# EAGLE design IMU (EAGLE 6.5.0)
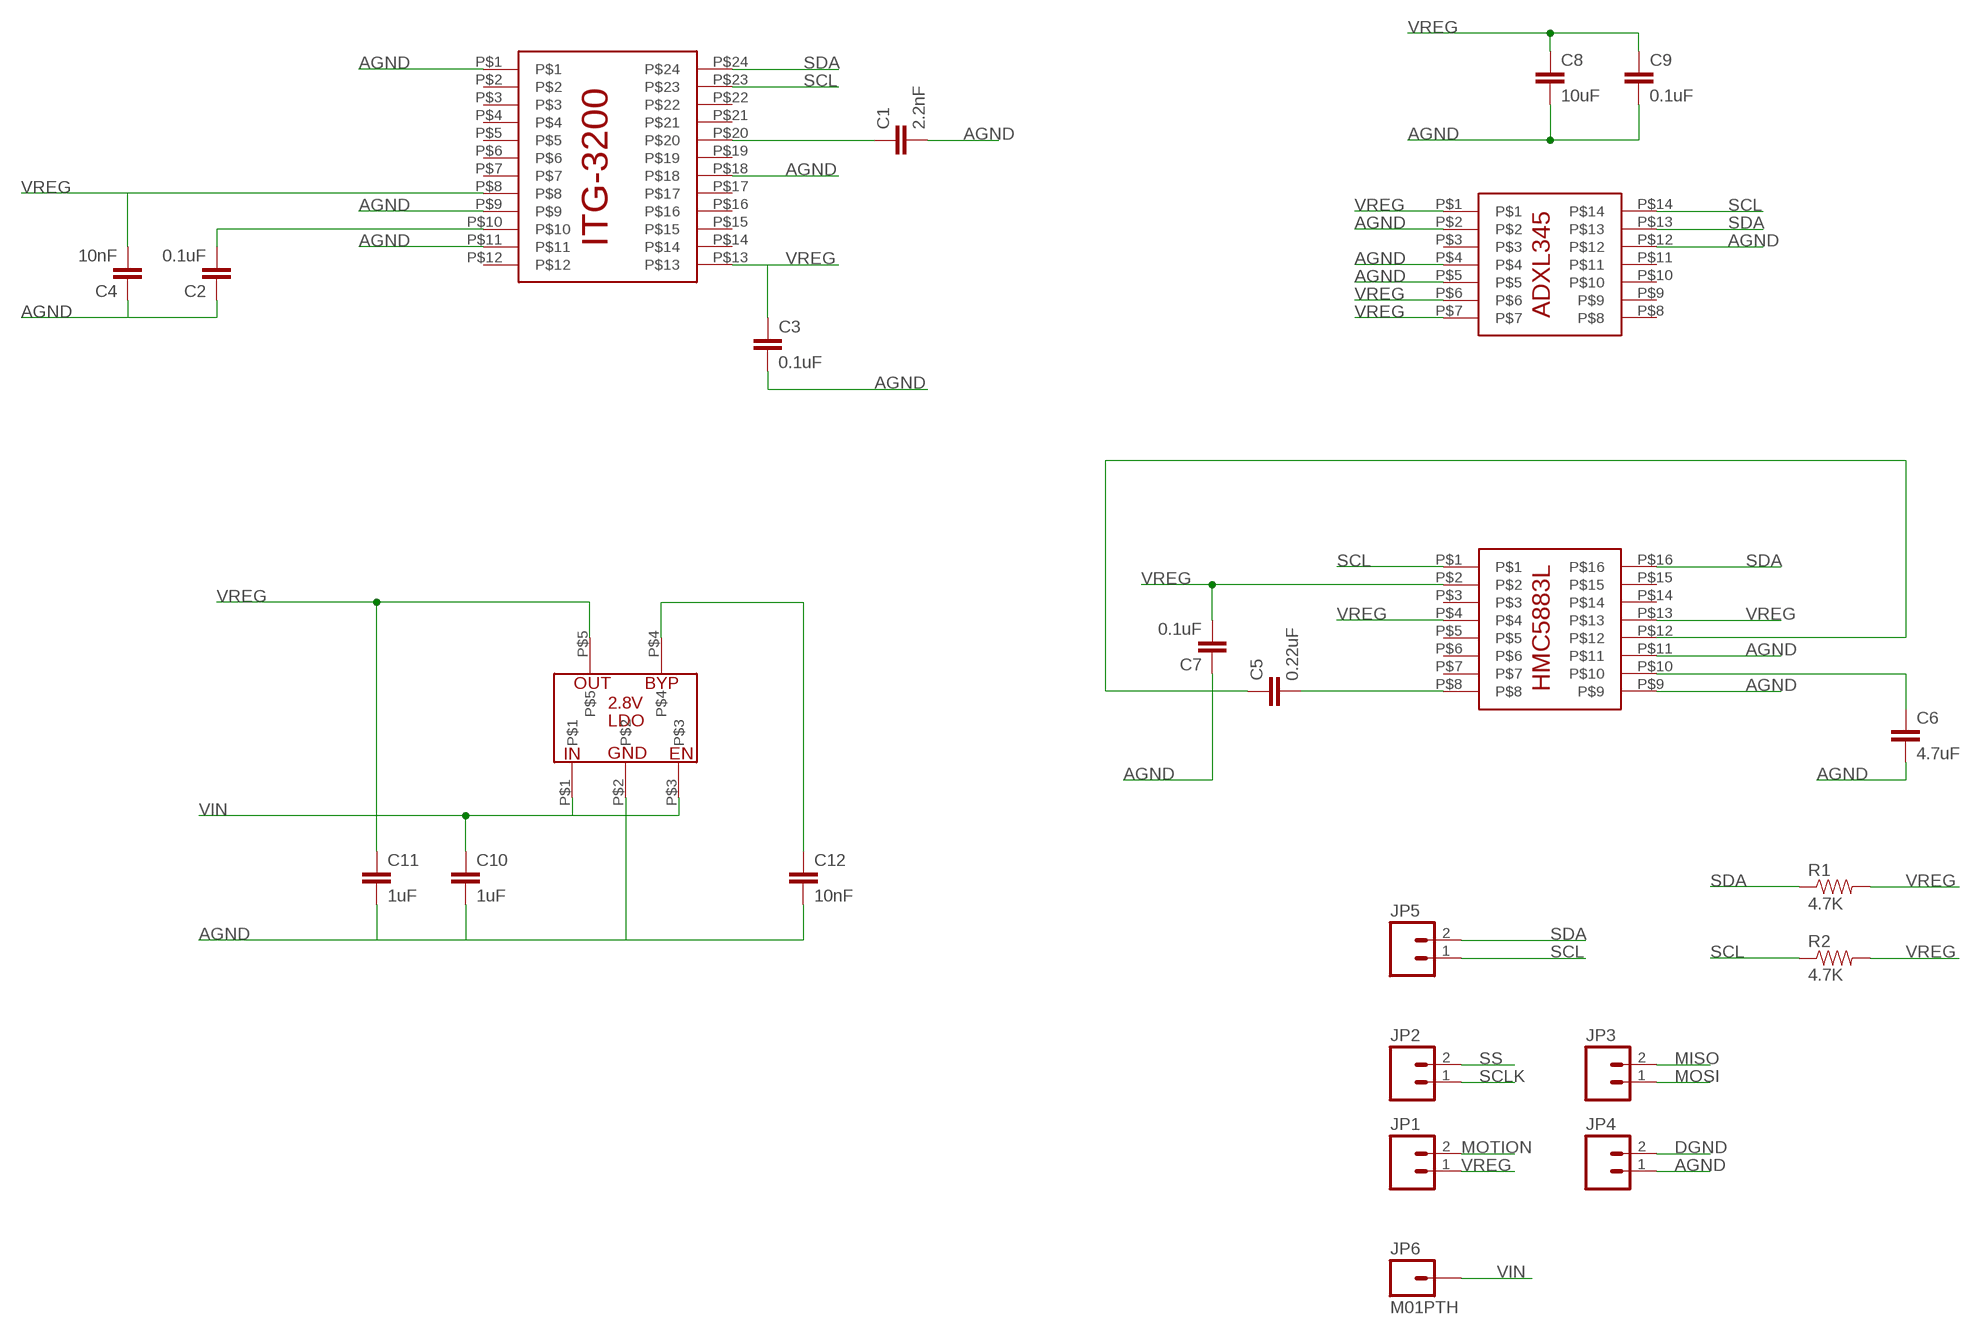
[diagram p0: schematic, sheet 1]

## Parts
C1  2.2nF  CAP0603-CAP  [0603-CAP]
C2  0.1uF  CAP0603-CAP  [0603-CAP]
C3  0.1uF  CAP0603-CAP  [0603-CAP]
C4  10nF  CAP0603-CAP  [0603-CAP]
C5  0.22uF  CAP0603-CAP  [0603-CAP]
C6  4.7uF  CAP0603-CAP  [0603-CAP]
C7  0.1uF  CAP0603-CAP  [0603-CAP]
C8  10uF  CAP0603-CAP  [0603-CAP]
C9  0.1uF  CAP0603-CAP  [0603-CAP]
C10  1uF  CAP0603-CAP  [0603-CAP]
C11  1uF  CAP0603-CAP  [0603-CAP]
C12  10nF  CAP0603-CAP  [0603-CAP]
JP1  M02PTH  [1X02]
JP2  M02PTH  [1X02]
JP3  M02PTH  [1X02]
JP4  M02PTH  [1X02]
JP5  M02PTH  [1X02]
JP6  M01PTH  [1X01]
R1  4.7K  RESISTOR0603-RES  [0603-RES]
R2  4.7K  RESISTOR0603-RES  [0603-RES]
U$2  ADXL345  [ADXL345]
U$3  HMC5883L  [HMC5883L]
U$4  ITG-3200  [ITG-3200]
U$5  NCP700BMT28TBG__2.8V_LDO  [NCP700BMT28TBG__2.8V_LDO]

## Nets
AGND: C1.2 C2.1 C3.2 C4.1 C6.2 C7.1 C8.2 C9.2 C10.2 C11.2 C12.2 JP4.1 U$2.P$2 U$2.P$4 U$2.P$5 U$2.P$12 U$3.P$9 U$3.P$11 U$4.P$1 U$4.P$9 U$4.P$11 U$4.P$18 U$5.P$2
DGND: JP4.2
MISO: JP3.2
MOSI: JP3.1
MOTION: JP1.2
N$2: C1.1 U$4.P$20
N$3: C2.2 U$4.P$10
N$4: C5.2 U$3.P$8
N$5: C5.1 U$3.P$12
N$6: C6.1 U$3.P$10
N$9: C12.1 U$5.P$4
SCL: JP5.1 R2.1 U$2.P$14 U$3.P$1 U$4.P$23
SCLK: JP2.1
SDA: JP5.2 R1.1 U$2.P$13 U$3.P$16 U$4.P$24
SS: JP2.2
VIN: C10.1 JP6.1 U$5.P$1 U$5.P$3
VREG: C3.1 C4.2 C7.2 C8.1 C9.1 C11.1 JP1.1 R1.2 R2.2 U$2.P$1 U$2.P$6 U$2.P$7 U$3.P$2 U$3.P$4 U$3.P$13 U$4.P$8 U$4.P$13 U$5.P$5
Unconnected: U$2.P$3 U$2.P$8 U$2.P$9 U$2.P$10 U$2.P$11 U$3.P$3 U$3.P$5 U$3.P$6 U$3.P$7 U$3.P$14 U$3.P$15 U$4.P$2 U$4.P$3 U$4.P$4 U$4.P$5 U$4.P$6 U$4.P$7 U$4.P$12 U$4.P$14 U$4.P$15 U$4.P$16 U$4.P$17 U$4.P$19 U$4.P$21 U$4.P$22

## Library data of the parts
C1-C12 = SparkFun-Capacitors:CAP: Capacitor Standard 0603 ceramic capacitor, and 0.1" leaded capacitor.
JP1-JP5 = SparkFun-Connectors:M02: Header 2 Standard 2-pin 0.1" header. Use with straight break away headers (SKU : PRT-00116), right angle break away headers (PRT-00553), swiss pins (PRT-00743), machine pins (PRT-00117), and female headers (PRT-00115). Molex polarized connector foot print use with SKU : PRT-08233 with associated crimp pins and housings.
JP6 = SparkFun-Connectors:M01: Header 1 Standard 1-pin 0.1" header. Use with straight break away headers (SKU : PRT-00116), right angle break away headers (PRT-00553), swiss pins (PRT-00743), machine pins (PRT-00117), and female headers (PRT-00115).
R1 R2 = SparkFun-Resistors:RESISTOR: Resistor Basic schematic elements and footprints for 0603, 1206, and PTH resistors.
U$2 = JKCustom:ADXL345
U$3 = JKCustom:HMC5883L
U$4 = JKCustom:ITG-3200
U$5 = JKCustom:NCP700BMT28TBG__2.8V_LDO

## Board
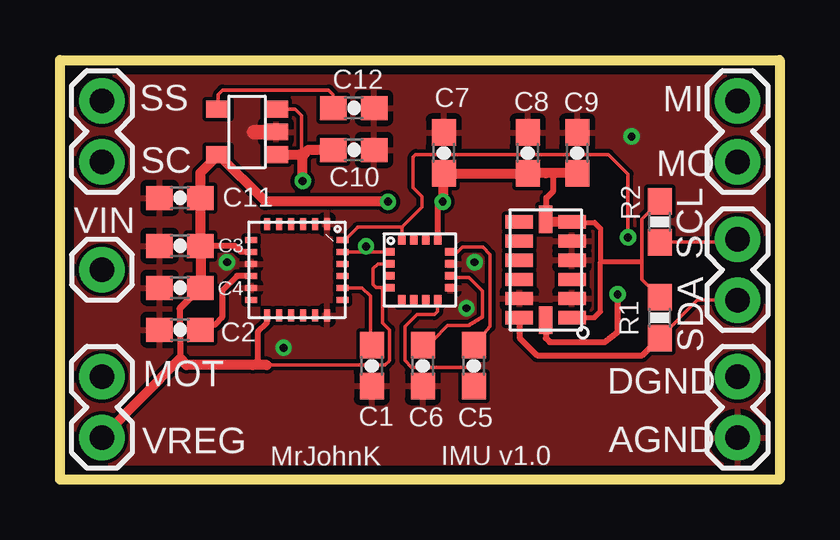
[diagram p1: board, top side]
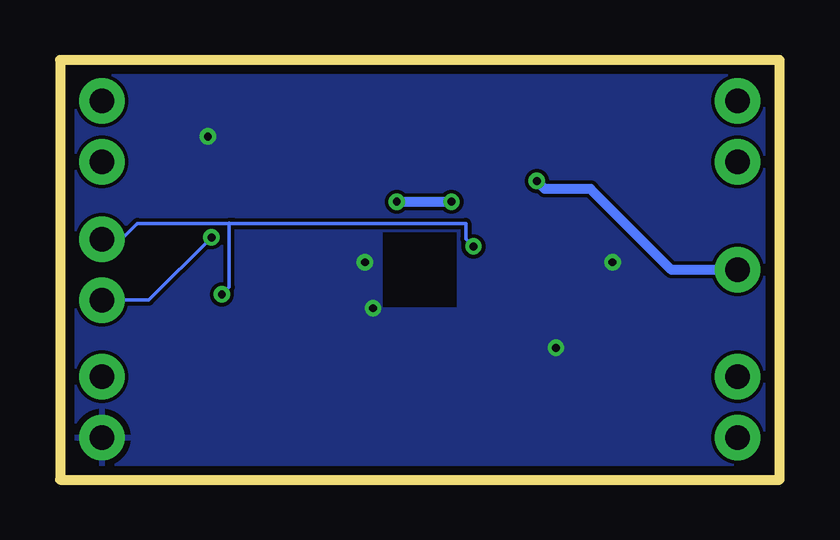
[diagram p2: board, bottom side, seen from below]

Size 30 x 17.5 mm. Coordinates in mm from the lower left corner, seen from the top.
Outline: 0,17.5 30,17.5 30,0 0,0 0,17.5
Copper layers (1*16): Top 0.0356mm / dielectric 1.5011mm / Bottom 0.0356mm
Design rules "LaenPCBOrder *": minimum track width 6mil, minimum drill 13mil, track to track 6mil, track to pad 6mil, pad to pad 6mil, via to via 6mil, smd to smd 6mil, copper to edge 15mil, drill to drill 6mil, minimum pad ring 7mil, minimum via ring 7mil, stop-mask expansion 3mil, vias tented up to drill 0mil, thermal gap 10mil
tKeepout: area 13.5,7.2 to 16.5,7.2; area 14,7.7 to 16,9.8; area 13.5,9.7 to 14,10.2; area 16,9.8 to 16.5,10.2; area 16,7.2 to 16.5,7.8; area 13.5,7.3 to 14,7.8
bKeepout: area 13.5,7.2 to 16.5,7.2; area 13.5,7.2 to 16.5,10.3; area 13.5,9.8 to 14,10.2; area 16,9.8 to 16.5,10.2; area 16,7.2 to 16.5,7.8; area 13.5,7.3 to 14,7.8
tRestrict: area 13.5,7.2 to 16.5,7.2; area 14,7.7 to 16,9.8; area 13.5,7.3 to 14,7.8; area 16,7.2 to 16.5,7.8; area 16,9.8 to 16.5,10.2; area 13.5,9.7 to 14,10.2
bRestrict: area 13.5,7.2 to 16.5,7.2; area 13.5,7.2 to 16.5,10.3; area 13.5,9.7 to 14,10.2; area 16,9.7 to 16.5,10.2; area 16,7.2 to 16.5,7.8; area 13.5,7.3 to 14,7.8

### Footprints (pad centres in the part's own frame; a part is rotated, then mirrored left to right if it is on the bottom)
0603-CAP = smd 1.1 x 1: 1 -0.85,0; 2 0.85,0
1X02 = drill 1.016 pad 1.88: 1 0,0; 2 2.54,0
1X01 = drill 1.016 pad 1.88: 1 0,0
0603-RES = smd 1.1 x 1: 1 -0.85,0; 2 0.85,0
ADXL345 = smd 1.145 x 0.55: P$1 -1.1,2; P$2 -1.1,1.2; P$3 -1.1,0.4; P$4 -1.1,-0.4; P$5 -1.1,-1.2; P$6 -1.1,-2; P$8 1.11,-2; P$9 1.1,-1.2; P$10 1.1,-0.4; P$11 1.1,0.4; P$12 1.1,1.2; P$13 1.1,2 | smd 0.55 x 1.145: P$7 0,-2.1; P$14 0,2.1
HMC5883L = smd 0.45 x 0.3: P$1 -1.275,0.75; P$2 -1.275,0.25; P$3 -1.275,-0.25; P$4 -1.275,-0.75; P$9 1.275,-0.75; P$10 1.275,-0.25; P$11 1.275,0.25; P$12 1.275,0.75 | smd 0.3 x 0.45: P$5 -0.75,-1.275; P$6 -0.25,-1.275; P$7 0.25,-1.275; P$8 0.75,-1.275; P$13 0.75,1.275; P$14 0.25,1.275; P$15 -0.25,1.275; P$16 -0.75,1.275
ITG-3200 = smd 0.5 x 0.25: P$1 -3.9,3.25; P$2 -3.9,2.75; P$3 -3.9,2.25; P$4 -3.9,1.75; P$5 -3.9,1.25; P$6 -3.9,0.75; P$13 -0.1,0.75; P$14 -0.1,1.25; P$15 -0.1,1.75; P$16 -0.1,2.25; P$17 -0.1,2.75; P$18 -0.1,3.25 | smd 0.25 x 0.5: P$7 -3.25,0.1; P$8 -2.75,0.1; P$9 -2.25,0.1; P$10 -1.75,0.1; P$11 -1.25,0.1; P$12 -0.75,0.1; P$19 -0.75,3.9; P$20 -1.25,3.9; P$21 -1.75,3.9; P$22 -2.25,3.9; P$23 -2.75,3.9; P$24 -3.25,3.9
NCP700BMT28TBG__2.8V_LDO = smd 0.7 x 1: P$1 0.95,0; P$2 0,0; P$3 -0.95,0; P$4 -0.95,-2.4; P$5 0.95,-2.4

### Placement (x,y rotation side)
C1  13,4.75 270 top
C2  5,6.25 0 top
C3  5,9.75 180 top
C4  5,8 0 top
C5  17.25,4.75 270 top
C6  15.12,4.75 270 top
C7  16,13.62 270 top
C8  19.5,13.62 90 top
C9  21.56,13.62 90 top
C10  12.25,13.75 0 top
C11  5,11.75 180 top
C12  12.25,15.5 0 top
JP1  1.75,1.75 90 top
JP2  1.75,13.25 90 top
JP3  28.25,13.25 90 top
JP4  28.25,1.75 90 top
JP5  28.25,10.02 270 top
JP6  1.75,8.75 0 top
R1  25,6.75 90 top
R2  25,10.75 90 top
U$2  20.25,8.75 180 top
U$3  15,8.75 0 top
U$4  7.88,6.75 270 top
U$5  9,14.5 270 top

### Tracks (layer width: path | path; a pad name or v marks a point on that pad's centre or on a via)
AGND  (via drill 0.33)
  Top 0.6: U$5.P$2 8.1,14.5
  other vias: 17.29,9.06 16.95,7.15 9.32,5.5 6.96,9.06 23.83,14.3
  pour Top: 0,17.5 30,17.5 30,0 0,0
  pour Bottom: 0,0 30,0 30,17.5 0,17.5
N$2
  Top 0.152: C1.1 12.94,5.66 12.94,7.65 12.59,8 U$4.P$20
N$3
  Top 0.152: U$4.P$10 | C2.2
  Top 0.25: U$4.P$10 7.38,8.5 6.75,7.88 6.75,6.75 6.46,6.46 6.06,6.46 C2.2
N$4
  Top 0.152: U$3.P$8 15.74,7.01 15.61,6.88 14.88,6.88 14.38,6.38 14.38,4.96 14.66,4.68 17.24,4.68 C5.2
N$5
  Top 0.152: U$3.P$12 16.57,9.5 16.77,9.7 17.62,9.7 17.93,9.39 17.93,9.27 17.93,6.38 C5.1
N$6
  Top 0.152: U$3.P$10 16.35,8.43 16.98,8.43 17.05,8.43 17.61,7.86 17.61,6.78 17.04,6.42 16.21,6.42 16.16,6.42 15.59,5.85 15.38,5.85 C6.1 15.14,5.6 15.31,5.6
N$9
  Top 0.152: U$5.P$4 6.6,16.06 6.78,16.24 11.2,16.24 11.39,16.05 C12.1
SCL  (via drill 0.33)
  Top 0.152: 12.76,9.5 U$4.P$23 | 12.76,9.5 U$3.P$1 | R2.1 28.24,9.9 JP5.1 | v12.76,9.72 12.76,9.56 12.76,9.5 | U$2.P$14
  Top 0.25: U$2.P$14 20.25,5.9 20.42,5.73 22.71,5.73 23.25,6.16 v23.25,7.72
  Bottom 0.152: v12.76,9.72 13.08,10.04 13.08,10.68 22.78,10.68 | 22.78,10.68 26.78,10.68 27.44,10.02 JP5.1 | 22.78,10.68 22.94,10.69 22.94,8.03 v23.25,7.72
SDA  (via drill 0.33)
  Top 0.152: U$3.P$16 14.25,10.53 | U$4.P$24 11.88,10 12.4,10.52 12.41,10.53 14.25,10.53 | JP5.2 26.58,7.48 R1.1 24.94,5.86 24.94,5.84 | U$2.P$13 | v23.68,10.1 23.68,12.75 22.87,13.56 15.4,13.56 14.83,13.56 14.72,13.45 14.72,12.18 15.09,11.81 15.09,11.37 14.25,10.53
  Top 0.25: U$2.P$13 19.16,5.91 19.89,5.18 24.28,5.18 R1.1
  Bottom 0.152: v23.68,10.1 26.3,7.48 JP5.2
VIN  (via drill 0.33)
  Top 0.152: 10.01,13.56 10.17,13.56 10.07,13.66 10.07,15.17 9.79,15.44 U$5.P$3 | 11.4,13.56 C10.1 | U$5.P$1 8.94,13.6
  Top 0.406: v10.12,12.45 10.12,13.45 10.01,13.56 U$5.P$1 | C10.1 10.35,13.74 10.17,13.56
  Bottom 0.406: JP6.1 4.51,8.75 7.88,12.12 9.79,12.12 v10.12,12.45
VREG  (via drill 0.33)
  Top 0.152: U$3.P$13 | 20.26,10.76 U$2.P$7 20.26,10.92 | U$2.P$6 21.42,10.72 | C8.1 19.44,12.74 | C9.1 | 20.26,12.72 20.26,12.78 | 16.06,12.74 C7.2 16,12.76 15.9,12.66 15.96,12.66 | R1.2 24.26,8.34 24.26,9.08 | 24.26,9.08 24.26,10.86 R2.2 | U$2.P$1 | 24.2,9.08 24.26,9.08 | U$5.P$5 | C11.1 5.86,11.68 | U$3.P$2 13.52,9 13.26,9 13.06,8.8 13.06,8.14 13.18,8.02 13.71,8.02 U$3.P$4 13.44,8 13.44,7.94 13.44,6.54 13.74,6.24 13.74,4.96 13.69,4.91 13.6,4.82 13.56,4.78 8.63,4.78 | 5.86,9.5 C3.1 | U$4.P$8 8.04,9.46 | C4.2 5.82,7.94 | 5.86,9.44 C3.1 | 5.86,9.82 C3.1 | JP1.1 | 15.76,11.39 v15.96,11.59
  Top 0.2: 24.2,9.08 22.54,9.08 | U$2.P$1 22.29,6.76 22.54,7.01 22.54,9.08 | 21.42,10.72 22.29,10.72 22.54,10.47 22.54,9.08
  Top 0.25: 5,7.13 5,5.05 | U$3.P$13 15.76,11.39 | U$4.P$8 7.55,9.5 7.3,9.75 C3.1 | 8.04,4.78 8.24,4.97 8.24,5.41 8.24,6.15 8.62,6.54 U$4.P$13 | 20.26,10.92 20.28,10.94 20.28,11.75 20.57,12.04 20.57,12.78
  Top 0.3: 5.82,7.94 5,7.13
  Top 0.406: 20.26,10.76 U$2.P$6 | C9.1 20.57,12.78 20.26,12.78 C8.1 | 19.44,12.74 16.06,12.74 | U$5.P$5 5.86,12.8 C11.1 | 5.86,9.44 C4.2 | 5.86,9.82 5.86,11.68 | JP1.1 5,5.05 5.27,4.78 8.04,4.78 8.63,4.78 | 15.96,12.66 v15.96,11.59 | v13.68,11.59 8.56,11.59 U$5.P$5
  Bottom 0.152: v13.68,11.59
  Bottom 0.406: v15.96,11.59 v13.68,11.59

### Text on the board
_tsilk: SS | MI | SC | MO | SCL | VIN | SDA | MOT | DGND | VREG | MrJohnK | IMU v1.0 | AGND